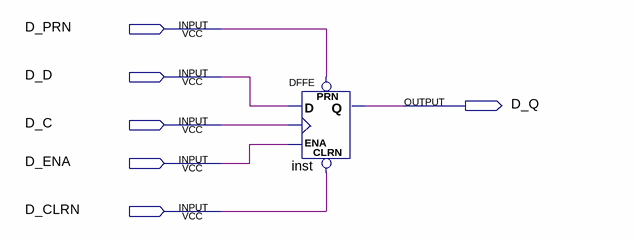
[diagram p0: schematic sheet]
// Quartus schematic lab_5_4.bdf as structural Verilog: 1 symbols, 6 pins
module lab_5_4 (
  input  D_PRN,
  input  D_D,
  input  D_C,
  input  D_ENA,
  input  D_CLRN,
  output D_Q
);

  DFFE inst (.PRN(D_PRN), .CLRN(D_CLRN), .D(D_D), .CLK(D_C), .ENA(D_ENA), .Q(D_Q));
endmodule
